# Altium schematic sheet Main Board.SchDoc: Main Board
size A4; SheetNumber: 1; SheetTotal: 10; Project: WSN Z1; Comments: Main board; PageSetup: Record=PageOptions|CenterHorizontal=True|CenterVertical=True|PrintScale=0.97|XCorrection=1.00|YCorrection=1.00|PrintKind=1|BorderSize=5000000|LeftOffset=0|BottomOffset=0|Orientation=2|PaperLength=2970|PaperWidth=2100|Scale=100|PaperSource=7|PrintQuality=1200|MediaType=1|DitherType=10|PaperKind=A4|PrintScaleMode=1
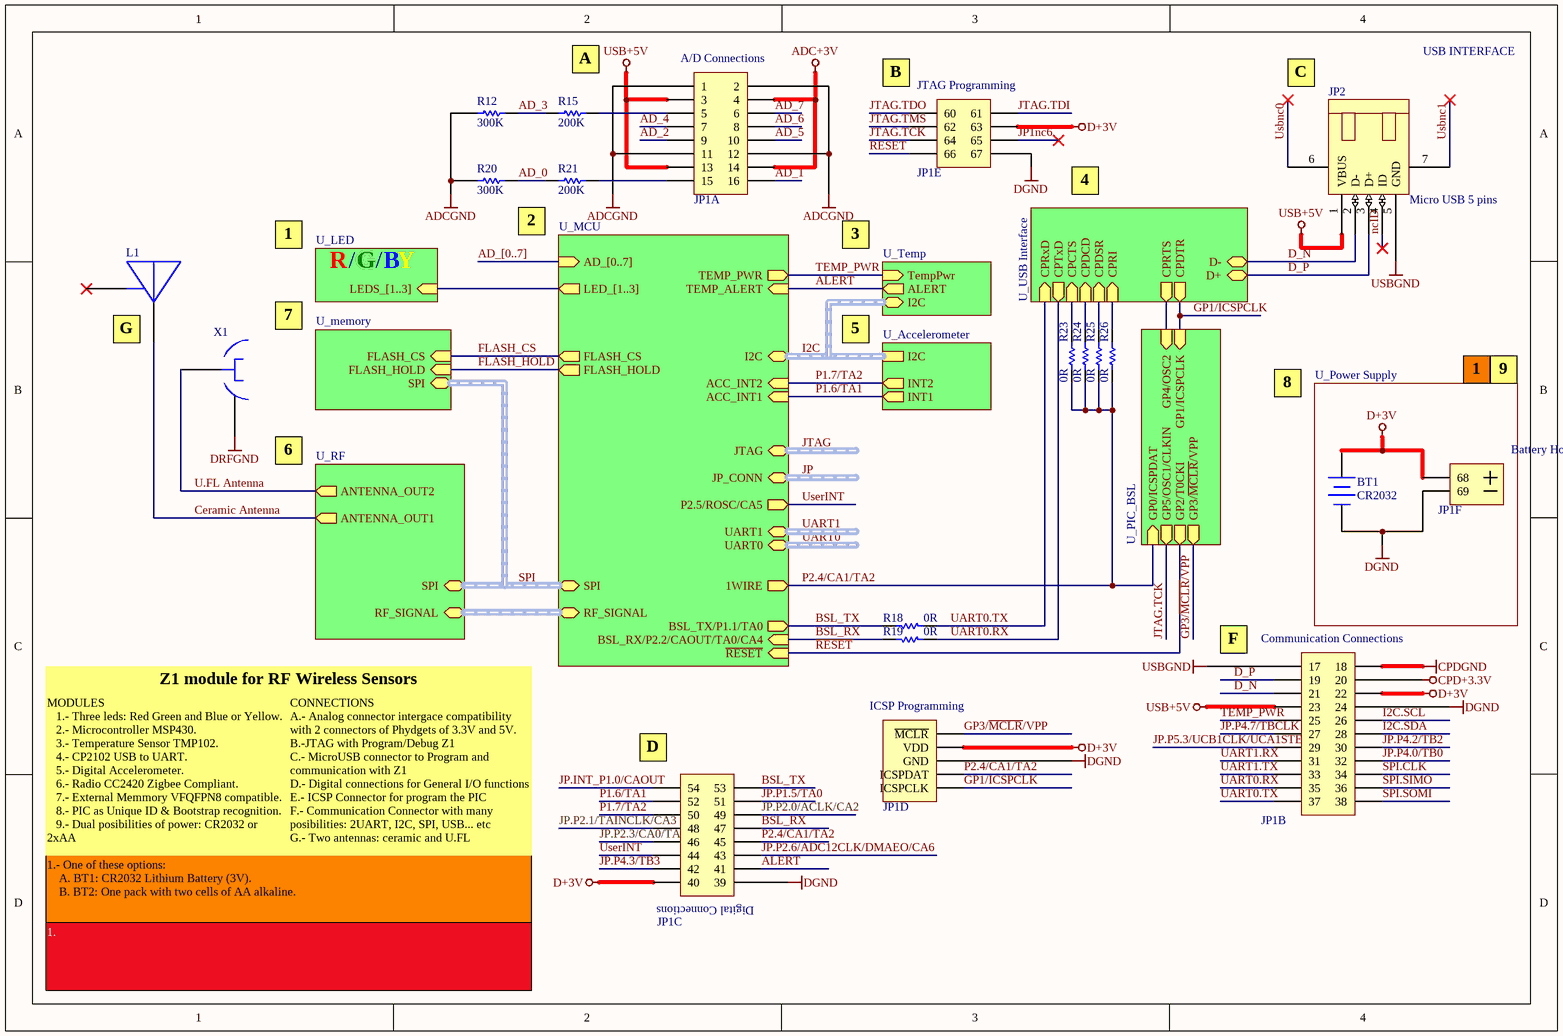
[diagram p0: Main Board.SchDoc]

## Parts
BT1  CR2032  [CR2032 - 796136-1]
JP1  Z1 Expansion Connector  [Z1 Expansion Connectors_RC2]  (value not drawn)  (parts A,B,C,D,E,F of 6)
JP2  Micro USB 5 pins  [ZX62D-B-5P8]
L1  Ceramic Antenna  [YAGEO - CAW431115300245]  (value not drawn)
R12  value 300K  [CR1005-0402]  (hidden comment: Res Semi)
R15  value 200K  [CR1005-0402]  (hidden comment: Res Semi)
R18  value 0R  [CR-0402-AL]  (hidden comment: Res Semi)
R19  value 0R  [CR-0402-AL]  (hidden comment: Res Semi)
R20  value 300K  [CR1005-0402]  (hidden comment: Res Semi)
R21  value 200K  [CR1005-0402]  (hidden comment: Res Semi)
R23  value 0R  [CR-0402-AL]  (hidden comment: Res Semi)
R24  value 0R  [CR-0402-AL]  (hidden comment: Res Semi)
R25  value 0R  [CR-0402-AL]  (hidden comment: Res Semi)
R26  value 0R  [CR-0402-AL]  (hidden comment: Res Semi)
X1  U.FL RF Connector  [U.FL]  (value not drawn)

## Sub-sheets
U_Accelerometer = Accelerometer.SchDoc: INT1 (out), INT2 (out), I2C (harness I2C)
U_LED = LED.SchDoc: LEDS_[1..3] (in)
U_MCU = MCU.SchDoc: 1WIRE (out), TEMP_ALERT (in), ACC_INT1 (in), ACC_INT2 (in), FLASH_CS (out), FLASH_HOLD (out), BSL_TX/P1.1/TA0 (out), BSL_RX/P2.2/CAOUT/TA0/CA4 (in), I2C (harness I2C), UART0 (harness UART0), UART1 (harness UART1), JTAG (harness JTAG), TEMP_PWR (out), ~{RESET} (in), AD_[0..7] (in), SPI (harness SPI), P2.5/ROSC/CA5 (out), LED_[1..3] (out), RF_SIGNAL (harness RADIO), JP_CONN (harness JP_CONN)
U_memory = memory.SchDoc: FLASH_CS (in), FLASH_HOLD (in), SPI (harness SPI)
U_PIC_BSL = PIC_BSL.SchDoc: GP0/ICSPDAT (in), GP2/T0CKI (out), GP1/ICSPCLK (in), GP4/OSC2 (in), GP5/OSC1/CLKIN (out), GP3/~{MCLR}/VPP (out)
U_Power Supply = Power Supply.SchDoc: no entries
U_RF = RF.SchDoc: ANTENNA_OUT2 (out), SPI (harness SPI), RF_SIGNAL (harness RADIO), ANTENNA_OUT1 (out)
U_Temp = Temp.SchDoc: ALERT (out), I2C (harness I2C), TempPwr (in)
U_USB Interface = USB Interface.SchDoc: CPRxD (in), CPTxD (out), CPRTS (out), CPCTS (in), CPDSR (in), CPDCD (in), CPDTR (out), CPRI (in), D- (bidir), D+ (bidir)

## Nets
ADC+3V: JP1.4 JP1.14
ADCGND: JP1.1 JP1.2 JP1.11 JP1.12 R12.2 R20.2
CPD+3.3V: JP1.20
CPDGND: JP1.18
D+3V: BT1.1(+) JP1.22 JP1.40 JP1.56(VDD) JP1.63 JP1.68
DGND: BT1.2(-) JP1.24 JP1.39 JP1.57(GND) JP1.67 JP1.69
DRFGND: X1.2(GND)
USB+5V: JP1.3 JP1.13 JP1.23 JP2.1(VBUS)
USBGND: JP1.17 JP2.5(GND)
AD_0: R20.1 R21.2
AD_1: JP1.16
AD_2: JP1.9
AD_3: R12.1 R15.2
AD_4: JP1.7
AD_5: JP1.10
AD_6: JP1.8
AD_7: JP1.6
ALERT: JP1.41 ; sheet U_MCU/TEMP_ALERT, sheet U_Temp/ALERT
BSL_RX: JP1.47 R19.2 ; sheet U_MCU/BSL_RX/P2.2/CAOUT/TA0/CA4
BSL_TX: JP1.53 R18.2 ; sheet U_MCU/BSL_TX/P1.1/TA0
Ceramic Antenna: L1.1(+) ; sheet U_RF/ANTENNA_OUT1
D_N: JP1.21 JP2.2(D-) ; sheet U_USB Interface/D-
D_P: JP1.19 JP2.3(D+) ; sheet U_USB Interface/D+
FLASH_CS: sheet U_memory/FLASH_CS, sheet U_MCU/FLASH_CS
FLASH_HOLD: sheet U_memory/FLASH_HOLD, sheet U_MCU/FLASH_HOLD
GP1/ICSPCLK: JP1.59(ICSPCLK) ; sheet U_USB Interface/CPDTR, sheet U_PIC_BSL/GP1/ICSPCLK
GP3/~{MCLR}/VPP: JP1.55(~{MCLR}) ; sheet U_PIC_BSL/GP3/~{MCLR}/VPP
I2C.SCL: JP1.26
I2C.SDA: JP1.28
JP1nc6: JP1.65
JP.INT_P1.0/CAOUT: JP1.54
JP.P1.5/TA0: JP1.51
JP.P2.0/ACLK/CA2: JP1.49
JP.P2.1/TAINCLK/CA3: JP1.48
JP.P2.3/CA0/TA1: JP1.46
JP.P2.6/ADC12CLK/DMAEO/CA6: JP1.43
JP.P4.0/TB0: JP1.32
JP.P4.2/TB2: JP1.30
JP.P4.3/TB3: JP1.42
JP.P4.7/TBCLK: JP1.27
JP.P5.3/UCB1CLK/UCA1STE: JP1.29
JTAG.TCK: JP1.64 ; sheet U_PIC_BSL/GP5/OSC1/CLKIN
JTAG.TDI: JP1.61
JTAG.TDO: JP1.60
JTAG.TMS: JP1.62
ncID: JP2.4(ID)
P1.6/TA1: JP1.52 ; sheet U_MCU/ACC_INT1, sheet U_Accelerometer/INT1
P1.7/TA2: JP1.50 ; sheet U_MCU/ACC_INT2, sheet U_Accelerometer/INT2
P2.4/CA1/TA2: JP1.45 JP1.58(ICSPDAT) R23.2 R24.2 R25.2 R26.2 ; sheet U_MCU/1WIRE, sheet U_PIC_BSL/GP0/ICSPDAT
~{RESET}: JP1.66 ; sheet U_MCU/~{RESET}, sheet U_PIC_BSL/GP2/T0CKI
SPI.CLK: JP1.34
SPI.SIMO: JP1.36
SPI.SOMI: JP1.38
TEMP_PWR: JP1.25 ; sheet U_MCU/TEMP_PWR, sheet U_Temp/TempPwr
U.FL Antenna: X1.1(+) ; sheet U_RF/ANTENNA_OUT2
UART0.RX: JP1.35 R19.1 ; sheet U_USB Interface/CPTxD
UART0.TX: JP1.37 R18.1 ; sheet U_USB Interface/CPRxD
UART1.RX: JP1.31
UART1.TX: JP1.33
Usbnc0: JP2.6(SH2)
Usbnc1: JP2.7(SH1)
UserINT: JP1.44 ; sheet U_MCU/P2.5/ROSC/CA5
NetJP1_5: JP1.5 R15.1
NetJP1_15: JP1.15 R21.1
NetR23_1: R23.1 ; sheet U_USB Interface/CPCTS
NetR24_1: R24.1 ; sheet U_USB Interface/CPDCD
NetR25_1: R25.1 ; sheet U_USB Interface/CPDSR
NetR26_1: R26.1 ; sheet U_USB Interface/CPRI
(unnamed): sheet U_USB Interface/CPRTS, sheet U_PIC_BSL/GP4/OSC2

Not connected (* = marked no-connect by the designer): L1 2(GND)*

## Buses and harness runs
bus AD_[0..7] = sheet U_MCU/AD_[0..7]
bus sheet U_LED/LEDS_[1..3] = sheet U_MCU/LED_[1..3]
harness I2C = sheet U_Accelerometer/I2C = sheet U_MCU/I2C = sheet U_Temp/I2C
harness JP = sheet U_MCU/JP_CONN
harness JTAG = sheet U_MCU/JTAG
harness sheet U_MCU/RF_SIGNAL = sheet U_RF/RF_SIGNAL
harness SPI = sheet U_MCU/SPI = sheet U_memory/SPI = sheet U_RF/SPI
harness UART0 = sheet U_MCU/UART0
harness UART1 = sheet U_MCU/UART1

## Notes on the sheet
- (near R15) A
- (near JP1) B
- C
- USB INTERFACE
- 1
- 2
- 3
- 4
- R
- /
- G
- B
- Y
- (near L1) G
- 7
- 5
- 9
- 8
- 6
- F
- Z1 module for RF Wireless Sensors
- (near JP1) D
- (near JP1) E
- MODULES
  1.- Three leds: Red Green and Blue or Yellow.
  2.- Microcontroller MSP430.
  3.- Temperature Sensor TMP102.
  4.- CP2102 USB to UART.
  5.- Digital Accelerometer.
  6.- Radio CC2420 Zigbee Compliant.
  7.- External Memmory VFQFPN8 compatible.
  8.- PIC as Unique ID & Bootstrap recognition.
  9.- Dual posibilities of power: CR2032 or 2xAA
- CONNECTIONS
  A.- Analog connector intergace compatibility with 2 connectors of Phydgets of 3.3V and 5V.
  B.-JTAG with Program/Debug Z1
  C.- MicroUSB connector to Program and communication with Z1
  D.- Digital connections for General I/O functions
  E.- ICSP Connector for program the PIC
  F.- Communication Connector with many posibilities: 2UART, I2C, SPI, USB... etc
  G.- Two antennas: ceramic and U.FL
- 1.- One of these options:
  A. BT1: CR2032 Lithium Battery (3V).
  B. BT2: One pack with two cells of AA alkaline.
- 1.
- (in symbol Z1_RC1, part A) A/D Connections
- (in symbol Z1_RC1, part B) Communication Connections
- (in symbol Z1_RC1, part C) Digital Connections
- (in symbol Z1_RC1, part D) ICSP Programming
- (in symbol Z1_RC1, part E) JTAG Programming
- (in symbol Z1_RC1, part F) Battery Holder

## Library data of the parts
BT1 = Battery: Multicell Battery; Value: +3.3V
JP1 = Z1_RC1
JP2 = USB 5 pins
L1 = 5.3x2.2 TDMA Antenna_1: ANT 2.4GHZ 802.11 BLUETOOTH SMD
R12 R15 R20 R21 R23-R26 = Res Semi: Semiconductor Resistor; Manufacturer: Generic Components
R18 R19 = Res Semi: RES ZERO OHM 1/10W 5% 0402 SMD
X1 = AntennaOmnidirectional: CONN RF MICROCOAXIAL SMD GOLD